# EAGLE design untitled (EAGLE 9.1.0)
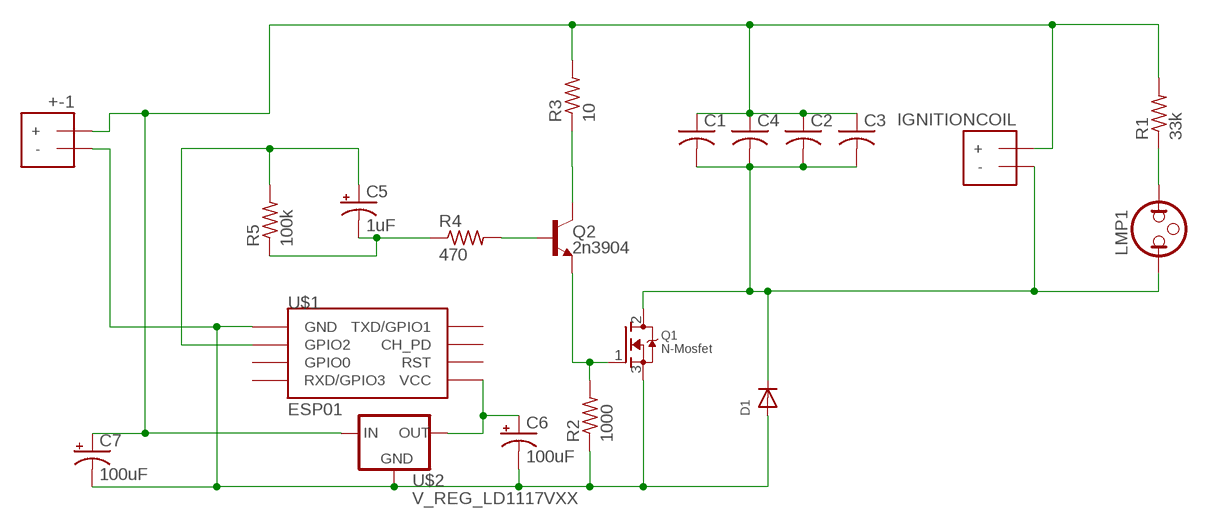
[diagram p0: schematic, sheet 1]

## Parts
+-1  1X2_-++-  [1X2_+-]
C1  C-US225-062X268  [C225-062X268]
C2  C-US225-062X268  [C225-062X268]
C3  C-US225-062X268  [C225-062X268]
C4  C-US225-062X268  [C225-062X268]
C5  1uF  CPOL-USE2-5  [E2-5]
C6  100uF  CPOL-USE2.5-6  [E2,5-6]
C7  100uF  CPOL-USE2.5-6  [E2,5-6]
D1  DIODEDO-1N4148  [DO-1N4148]
IGNITIONCOIL  1X2_-++-  [1X2_+-]
LMP1  NEON  [LDH-3R]
Q1  N-Mosfet  MOSFET-NGDS_TO220V  [TO220V]
Q2  2n3904  TRANS_NPN  [TO-92INSERT]
R1  33k  R-US_0204/7  [0204/7]
R2  1000  R-US_0204/7  [0204/7]
R3  10  R-US_0204/7  [0204/7]
R4  470  R-US_0204/7  [0204/7]
R5  100k  R-US_0204/7  [0204/7]
U$1  ESP01  [ESP01]
U$2  V_REG_LD1117VXX  [78XXL]

## Nets
N$1: Q2.2(B) R4.2
N$2: C5.- R4.1 R5.1
N$3: +-1.- C6.- C7.- D1.A Q1.3(S) R2.1 U$1.GND U$2.IN(GND)
N$4: LMP1.2 R1.1
N$5: Q2.1(C) R3.1
N$6: Q1.1(G) Q2.3(E) R2.2
N$7: +-1.+ C1.1 C2.1 C3.1 C4.1 C7.+ IGNITIONCOIL.+ R1.2 R3.2 U$2.OUT(IN)
N$8: C1.2 C2.2 C3.2 C4.2 D1.C IGNITIONCOIL.- LMP1.1 Q1.2(D)
N$9: C5.+ R5.2 U$1.GPIO2
N$13: C6.+ U$1.VCC U$2.GND(OUT)
Unconnected: U$1.CH_PD U$1.GPIO0 U$1.RST U$1.RX(RXD/GPIO3) U$1.TX(TXD/GPIO1)

## Library data of the parts
+-1 IGNITIONCOIL = aaaacustom:1X2_-+
C1-C4 = adafruit:C-US: CAPACITOR, American symbol
C5-C7 = adafruit:CPOL-US: POLARIZED CAPACITOR, American symbol
D1 = adafruit:DIODE: Diode SMADIODE - SMA Surface Mount Package 20V 1A Schottky Diode Digikey: 641-1014-6-ND DO-1N4148 - Through Hole Small Current Diode SOD-123 20V 1 A (.5mV Vf) Schottky Diode - Digikey: MBRX120TPMSCT-ND SOD-323 10V 570mA (.38mV Vf, 3ns) Schottky Diode - Digikey: ZLLS410CT-ND SOD-523 30V 30mA Schottky Diode (RB751S-40TE61) - Digikey: RB751S-40TE61CT-ND SOT23-R/W - SOT23 Package (R = Solder Paste/Reflow Ovens, W = Hand-Soldering) BAT54Film 40V 300mA - Digikey: 497-7162-1-ND
LMP1 = special:NEON: Neon LAMP
Q1 = adafruit:MOSFET-N: N-Channel Mosfet 2N7002E - 60V 260mA SOT23 [Digikey: 2N7002ET1GOSTR-ND] - REEL BSH103 - 30V 850mA SOT23 [Digikey: 568-5013-1-ND]
Q2 = SparkFun-DiscreteSemi:TRANS_NPN: NPN transistor Current controlled devices typically used to amplify current or used as a switch. BC547 - COM-08928 <http://www.sparkfun.com/products/8928> (TO-92 45V 100mA) (1.Collector 2.Base 3.Emitter) 2N3904 - COM-00521 <http://www.sparkfun.com/products/521> (TO-92 40V 200mA) (1.Emitter 2.Base 3.Collector) P2N2222A - COM-12852 <http://www.sparkfun.com/products/12852> (TO-92 40V 600mA) (1.Collector 2.Base 3.Emitter)
R1-R5 = adafruit:R-US_: RESISTOR, American symbol
U$1 = esp8266modules:ESP01: ESP8266 Wifi module 01
U$2 = SparkFun-IC-Power:V_REG_LD1117VXX: LD1117VXX voltage regulator. We carry the 3.3V version (COM-00526) in TO-220 package.

## Board
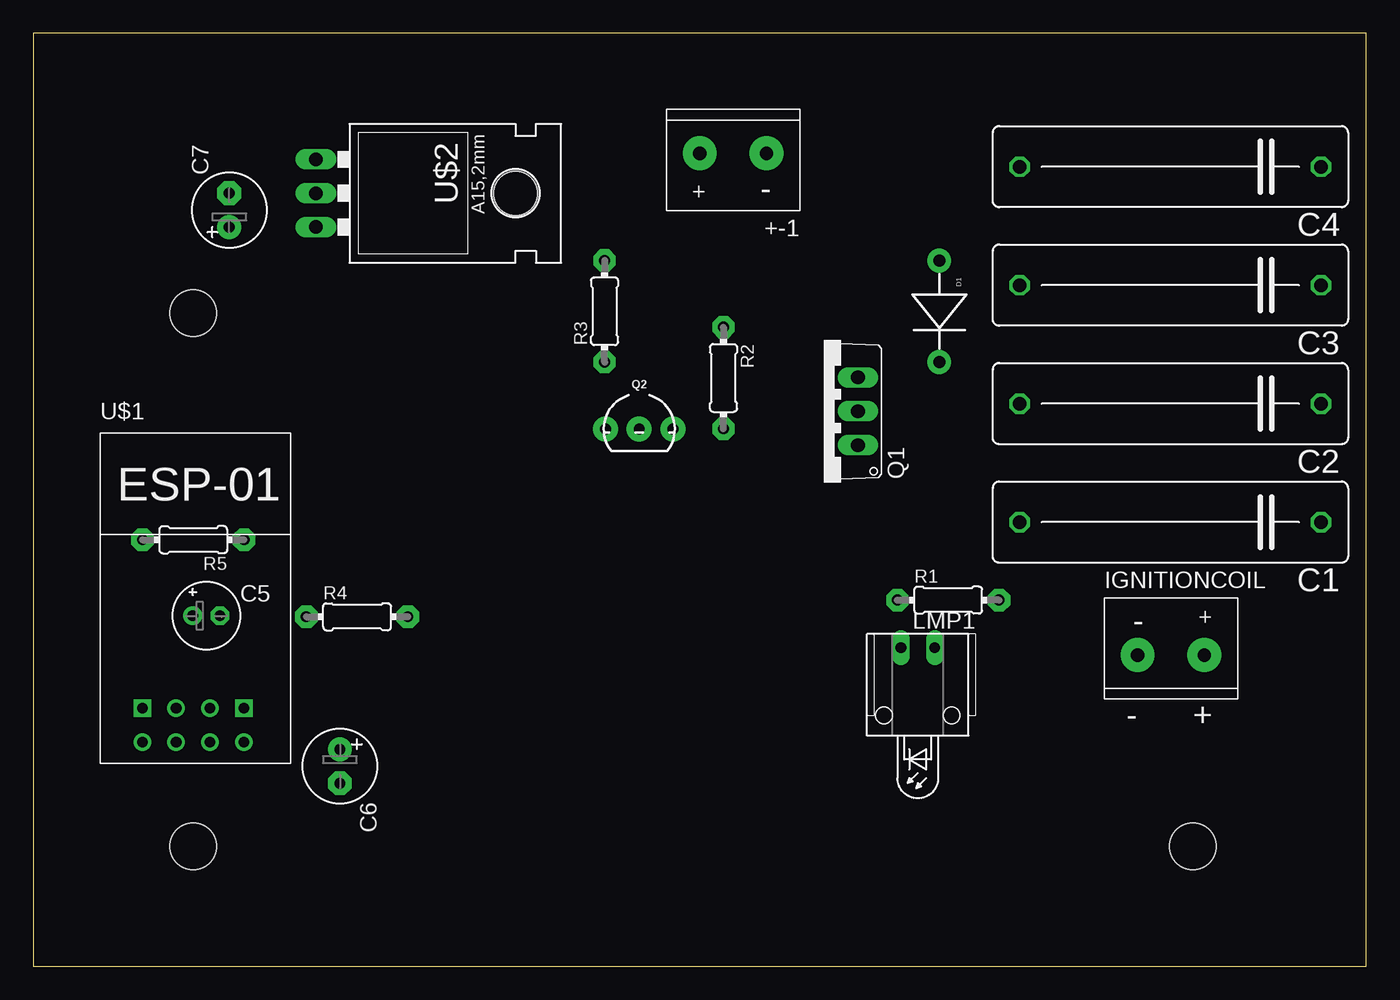
[diagram p1: board, top side]
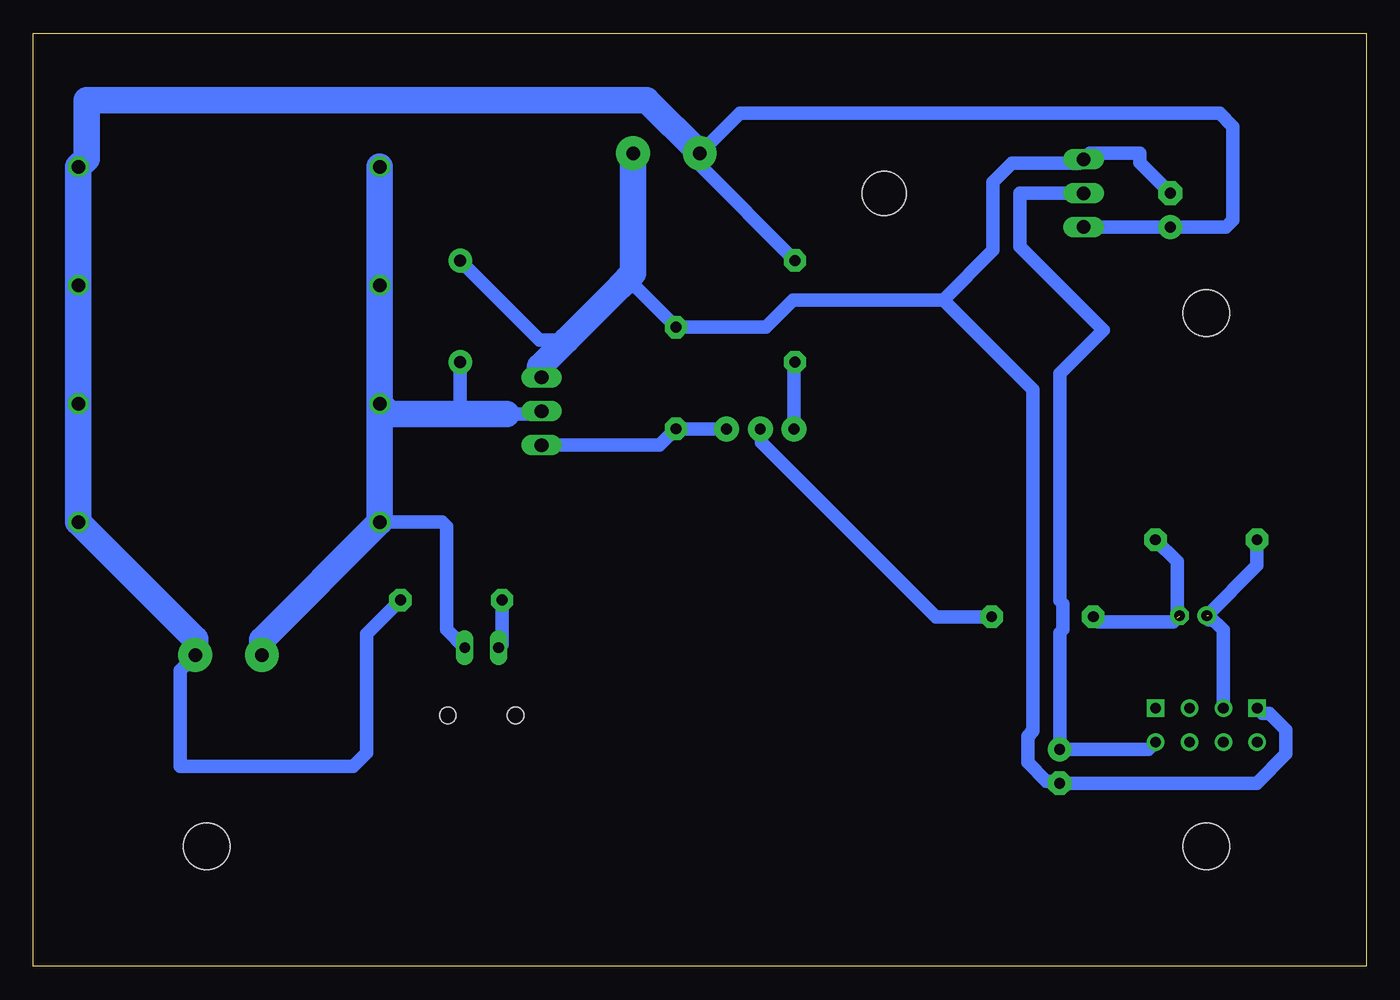
[diagram p2: board, bottom side, seen from below]

Size 100 x 70 mm. Coordinates in mm from the lower left corner, seen from the top.
Outline: 0,0 100,0 100,70 0,70 0,0
Copper layers (1*16): Top 0.035mm / dielectric 1.5mm / Bottom 0.035mm
Design rules "default": minimum track width 1mm, minimum drill 1mm, track to track 1mm, track to pad 1mm, pad to pad 0.5mm, via to via 1mm, smd to smd 6mil, copper to edge 0.5mm, drill to drill 0.5mm, minimum pad ring 10mil, minimum via ring 8mil, stop-mask expansion 4mil, vias tented up to drill 0mil, thermal gap 10mil
Holes 3.5 mm at 12,9 12,49 87,9

### Footprints (pad centres in the part's own frame; a part is rotated, then mirrored left to right if it is on the bottom)
1X2_+- = drill 1 pad 2.54: + 0,0; - 5,0
C225-062X268 = drill 1.016 octagon: 1 -11.303,0; 2 11.303,0
E2-5 = drill 0.813 pad 1.422: + -1.016,0 | drill 0.813 pad 1.422 octagon: - 1.016,0
E2,5-6 = drill 0.813 pad 1.778: + -1.27,0 | drill 0.813 pad 1.778 octagon: - 1.27,0
DO-1N4148 = drill 0.9 pad 1.778: A -3.81,0; C 3.81,0
LDH-3R = drill 0.813 long: 1 -1.27,-5.08; 2 1.27,-5.08 | hole 1.219: 2.54,0; -2.54,0
TO220V = drill 1.016 long: 1 -2.54,-2.54; 2 0,-2.54; 3 2.54,-2.54
TO-92INSERT = drill 0.813 pad 1.88: 1 -2.54,0; 2 0,0; 3 2.54,0
0204/7 = drill 0.813 pad 1.676 octagon: 1 -3.81,0; 2 3.81,0
ESP01 = drill 0.8: CH_PD -1.285,-8.178; GPIO0 1.255,-5.638; GPIO2 -1.285,-5.638; RST 1.255,-8.178; TX -3.825,-8.178; VCC 3.795,-8.178 | drill 0.8 square: GND -3.825,-5.638; RX 3.795,-5.638
78XXL = drill 1.016 long: GND 0,-3.81; IN -2.54,-3.81; OUT 2.54,-3.81 | hole 3.302: 0,11.176

### Placement (x,y rotation side)
+-1  50,61 0 top
C1  85.31,33.32 180 top
C2  85.31,42.21 180 top
C3  85.31,51.1 180 top
C4  85.31,59.99 180 top
C5  12.98,26.3 0 top
C6  23,15 270 top
C7  14.7,56.73 90 top
D1  67.97,49.14 270 top
IGNITIONCOIL  87.85,23.35 180 top
LMP1  66.36,18.82 180 top
Q1  59.33,41.64 90 top
Q2  45.46,40.3 0 top
R1  68.64,27.47 0 top
R2  51.78,44.14 270 top
R3  42.86,49.14 90 top
R4  24.29,26.22 0 top
R5  12,32 180 top
U$1  12,25 0 top
U$2  25,58 270 top

### Tracks (layer width: path | path; a pad name or v marks a point on that pad's centre or on a via)
N$1
  Bottom 1: R4.2 32.29,26.22 45.36,39.29 45.36,40.2 Q2.2
N$2  (1 unrouted)
  Bottom 1: R5.1 14.18,30.37 14.18,26.12 14.48,25.82 20.08,25.82 R4.1
N$3
  Bottom 1: 62,45 61.87,44.87 Q1.3 | D1.A 62.02,47 60,47 | C7.- 17,60.3 17,61 20.73,61 U$2.IN 21.47,60.26 26.57,60.26 28,58.83 28,53.73 31.73,50 | U$1.GND 7.79,18.98 7.28,18.98 6.02,17.71 6.02,15.93 8.22,13.73 C6.- 23.15,13.88 23.99,13.88 25.39,15.28 25.39,17.26 25,17.65 25,43.27 31.73,50 | 31.73,50 43,50 45.05,47.95 R2.1 54.83,51 56,51
  Bottom 2: +-1.- 55,52 56,51 60,47 62,45
N$4
  Bottom 1: R1.1 64.83,24.16 LMP1.2
N$5
  Bottom 1: R3.1 42.92,45.27 Q2.1
N$6
  Bottom 1: Q2.3 51.75,40.3 R2.2 53.01,39.1 Q1.1
N$7
  Bottom 1: R1.2 75,24.92 75,16 76,15 89,15 89,22.2 IGNITIONCOIL.+ | U$2.OUT C7.+ 10.54,55.46 10,56 10,63 11,64 47,64 +-1.+ 50,60.09 R3.2
  Bottom 2: IGNITIONCOIL.+ 87.85,24.56 C1.1 C2.1 C3.1 C4.1 96,60.6 96,65 54,65 +-1.+
N$8
  Bottom 1: 64.5,41.42 62.09,41.42 Q1.2 | LMP1.1 69,25.27 69,33 69.32,33.32 C1.2 | D1.C 68,45.3 68,41.42
  Bottom 2: C4.2 C3.2 C2.2 | C2.2 C1.2 82.85,24.48 IGNITIONCOIL.- | 64.5,41.42 68,41.42 73.22,41.42 C2.2
N$9  (1 unrouted)
  Bottom 1: C5.+ 8.19,30.08 R5.2 | 11.79,26 11.79,26.3 10.71,25.23 U$1.GPIO2
N$13
  Bottom 1: U$2.GND 26,58 26,54 19.73,47.73 23,44.46 23,27.43 22.76,27.19 22.76,25.25 23,25.01 C6.+ 16.35,16.27 U$1.VCC

### Text on the board
_tsilk: - | +